# Altium schematic sheet driver.SchDoc
size A4
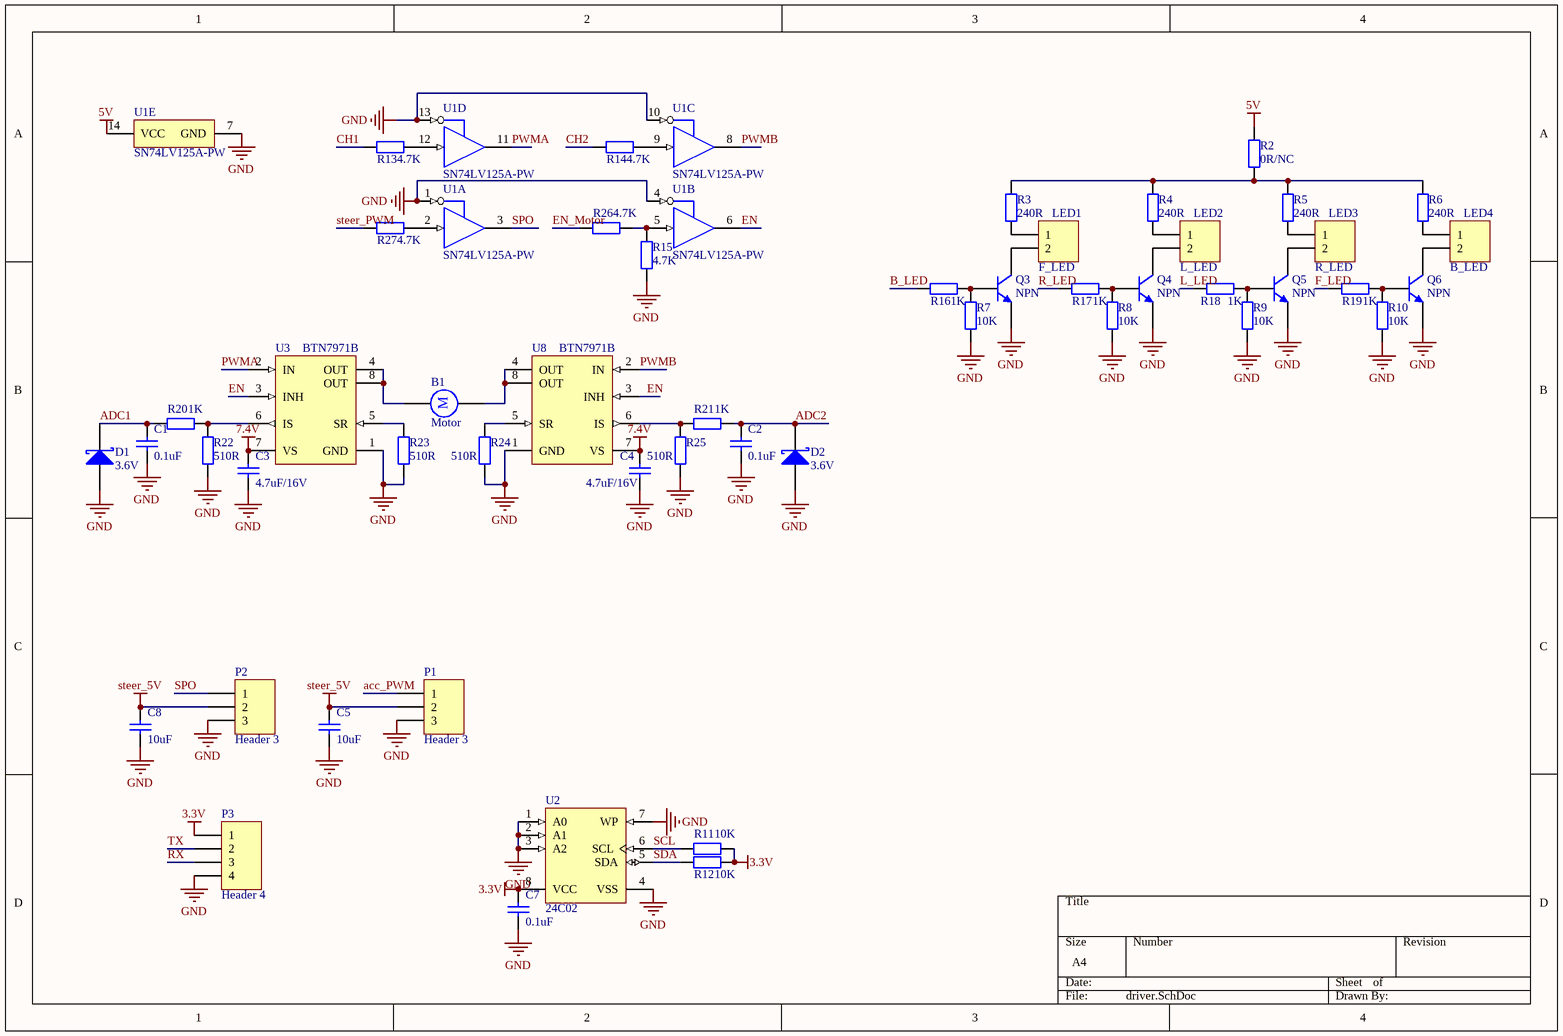
[diagram p0: driver.SchDoc]

## Parts
B1  Motor  [7.4V]
C1  0.1uF  [C0603]
C2  0.1uF  [C0603]
C3  4.7uF/16V  [6-0805_M]
C4  4.7uF/16V  [6-0805_M]
C5  10uF  [C0603]
C7  0.1uF  [C0603]
C8  10uF  [C0603]
D1  3.6V  [C1206]
D2  3.6V  [C1206]
LED1  F_LED  [HDR1X2]
LED2  L_LED  [HDR1X2]
LED3  R_LED  [HDR1X2]
LED4  B_LED  [HDR1X2]
P1  Header 3  [HDR1X3]
P2  Header 3  [HDR1X3]
P3  Header 4  [HDR1X4]
Q3  NPN  [SOT23-3]
Q4  NPN  [SOT23-3]
Q5  NPN  [SOT23-3]
Q6  NPN  [SOT23-3]
R2  0R/NC  [R0603]
R3  240R  [R0603]
R4  240R  [R0603]
R5  240R  [R0603]
R6  240R  [R0603]
R7  10K  [R0603]
R8  10K  [R0603]
R9  10K  [R0603]
R10  10K  [R0603]
R11  10K  [R0603]
R12  10K  [R0603]
R13  4.7K  [R0603]
R14  4.7K  [R0603]
R15  4.7K  [R0603]
R16  1K  [R0603]
R17  1K  [R0603]
R18  1K  [R0603]
R19  1K  [R0603]
R20  1K  [R0603]
R21  1K  [R0603]
R22  510R  [R0603]
R23  510R  [R0603]
R24  510R  [R0603]
R25  510R  [R0603]
R26  4.7K  [R0603]
R27  4.7K  [R0603]
U1  SN74LV125A-PW  [TSSOP-14]  (parts A,B,C,D,E of 5)
U2  24C02  [SOP-8]
U3  BTN7971B  [INF-PG-TO263-7-1_L - Cloned]
U8  BTN7971B  [INF-PG-TO263-7-1_L - Cloned]

## Nets
3.3V: C7.2 P3.1 R11.2 R12.2 U2.8(VCC)
5V: R2.1 U1.14(VCC)
7.4V: C3.2 C4.2 U3.7(VS) U8.7(VS)
GND: C1.1 C2.1 C3.1 C4.1 C5.1 C7.1 C8.1 D1.1(A) D2.1(A) P1.3 P2.3 P3.4 Q3.2(E) Q4.2(E) Q5.2(E) Q6.2(E) R7.2 R8.2 R9.2 R10.2 R15.1 R22.2 R23.2 R24.2 R25.2 U1.1(1~{OE}) U1.4(2~{OE}) U1.7(GND) U1.10(3~{OE}) U1.13(4~{OE}) U2.1(A0) U2.2(A1) U2.3(A2) U2.4(VSS) U2.7(WP) U3.1(GND) U8.1(GND)
steer_5V: C5.2 C8.2 P1.2 P2.2
acc_PWM: P1.1
ADC1: C1.2 D1.2(K) R20.1
ADC2: C2.2 D2.2(K) R21.2
B_LED: R16.1
CH1: R13.1
CH2: R14.1
EN: U1.6(2Y) U3.3(INH) U8.3(INH)
EN_Motor: R26.1
F_LED: R19.1
L_LED: R18.1
PWMA: U1.11(4Y) U3.2(IN)
PWMB: U1.8(3Y) U8.2(IN)
R_LED: R17.1
RX: P3.3
SCL: R11.1 U2.6(SCL)
SDA: R12.1 U2.5(SDA)
SPO: P2.1 U1.3(1Y)
steer_PWM: R27.1
TX: P3.2
NetB1_1: B1.1 U3.4(OUT) U3.8(OUT)
NetB1_2: B1.2 U8.4(OUT) U8.8(OUT)
NetLED1_1: LED1.1 R3.2
NetLED1_2: LED1.2 Q3.3(C)
NetLED2_1: LED2.1 R4.2
NetLED2_2: LED2.2 Q4.3(C)
NetLED3_1: LED3.1 R5.2
NetLED3_2: LED3.2 Q5.3(C)
NetLED4_1: LED4.1 R6.2
NetLED4_2: LED4.2 Q6.3(C)
NetQ3_1: Q3.1(B) R7.1 R16.2
NetQ4_1: Q4.1(B) R8.1 R17.2
NetQ5_1: Q5.1(B) R9.1 R18.2
NetQ6_1: Q6.1(B) R10.1 R19.2
NetR2_2: R2.2 R3.1 R4.1 R5.1 R6.1
NetR13_2: R13.2 U1.12(4A)
NetR14_2: R14.2 U1.9(3A)
NetR15_2: R15.2 R26.2 U1.5(2A)
NetR20_2: R20.2 R22.1 U3.6(IS)
NetR21_1: R21.1 R25.1 U8.6(IS)
NetR23_1: R23.1 U3.5(SR)
NetR24_1: R24.1 U8.5(SR)
NetR27_2: R27.2 U1.2(1A)

## Notes on the sheet
- (in symbol Motor) M

## Library data of the parts
B1 = Motor: Motor, General Kind; Published: 24-Mar-1999; LatestRevisionDate: 17-Jul-2002; LatestRevisionNote: Re-released for DXP Platform.; PackageReference: RB5-10.5; Publisher: Altium Limited; PackageDescription: Capacitor (Radial); 2 Leads
C1-C5 C7 C8 = Cap: Capacitor; Value: 100pF; Published: 8-Jun-2000; LatestRevisionDate: 17-Jul-2002; LatestRevisionNote: Re-released for DXP Platform.; PackageReference: RAD-0.3; Publisher: Altium Limited; PackageDescription: Radial Cap, Thru-Hole; 2 Leads; 0.3 in Pin Spacing
D1 D2 = D Schottky: Schottky Diode; Published: 8-Jun-2000; LatestRevisionDate: 17-Jul-2002; LatestRevisionNote: Re-released for DXP Platform.; PackageReference: SMB; Publisher: Altium Limited; PackageDescription: DO-214-AA/SMB; 2 C-Bend Leads; Body 5.3 x 3.6 mm, inc. leads (LxW); Code_JEDEC: DO-214-AA
LED1-LED4 = Header 2: Header, 2-Pin; LatestRevisionDate: 17-Jul-2002; LatestRevisionNote: Re-released for DXP Platform.; Publisher: Altium Limited
P1 P2 = Header 3: Header, 3-Pin; LatestRevisionDate: 17-Jul-2002; LatestRevisionNote: Re-released for DXP Platform.; Publisher: Altium Limited
P3 = Header 4: Header, 4-Pin; LatestRevisionDate: 17-Jul-2002; LatestRevisionNote: Re-released for DXP Platform.; Publisher: Altium Limited
R2-R15 R22-R27 = Res2: Resistor; Value: 1K; Published: 8-Jun-2000; LatestRevisionDate: 17-Jul-2002; LatestRevisionNote: Re-released for DXP Platform.; PackageReference: AXIAL-0.4; Publisher: Altium Limited; PackageDescription: Axial Device, Thru-Hole; 2 Leads; 0.4 in Pin Spacing
R16-R21 = Res2: Resistor; Published: 8-Jun-2000; LatestRevisionDate: 17-Jul-2002; LatestRevisionNote: Re-released for DXP Platform.; PackageReference: AXIAL-0.4; Publisher: Altium Limited; PackageDescription: Axial Device, Thru-Hole; 2 Leads; 0.4 in Pin Spacing; Value: 1K
U3 U8 = INF-BTN79XXX-PG-TO263-7-1-8